# Altium schematic sheet AirBee.SchDoc
size A4
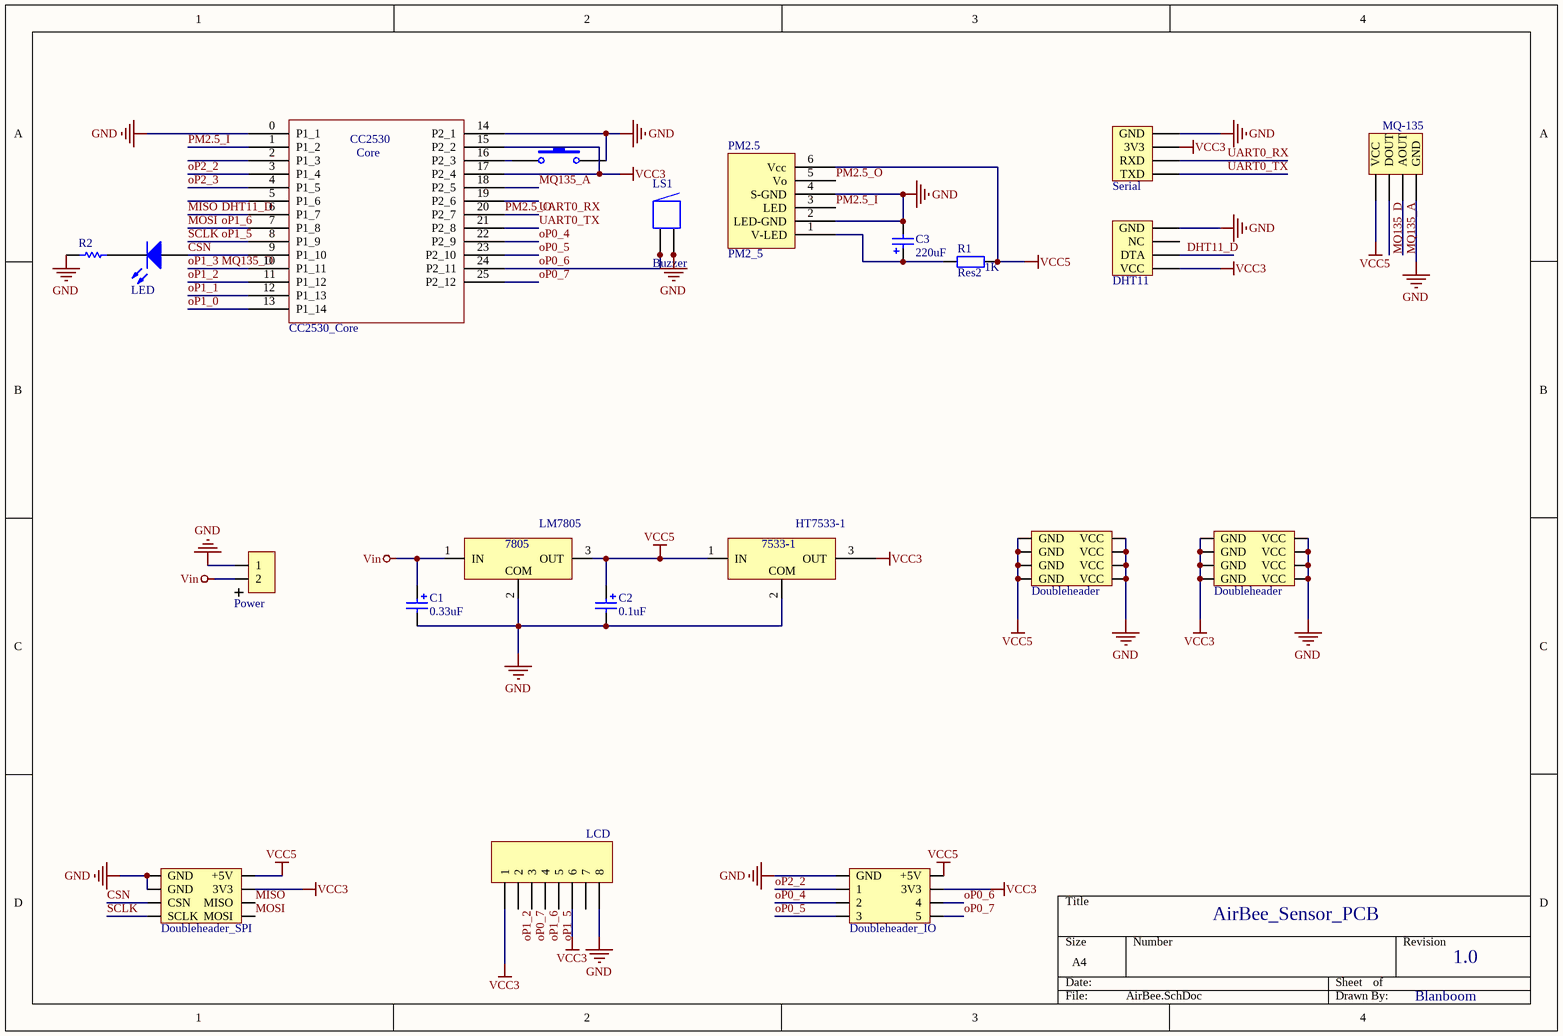
[diagram p0: AirBee.SchDoc]

## Parts
2530  CC2530_Core  [CC2530_Core]
7533  HT7533-1  [PNP]
7805  LM7805  [7805]
C1  0.33uF  [CAP-10uF]
C2  0.1uF  [CAP-10uF]
C3  220uF  [CAP-100uF]
D1  LED  [LED]
DHT11  DHT11  [DHT11]  (value not drawn)
IO2  Doubleheader_IO  [header16]
LCD  HEAder8  [header8]  (value not drawn)
LS1  Buzzer  [5V-BUZZER]
MQ-135  MQ_135  [MQ_135]  (value not drawn)
PM2.5  PM2_5  [PM2.5]
Power  Power  [dianyuan]
PWR5V  Doubleheader  [header16]
PWR33  Doubleheader  [header16]
R1  Res2  value 1K  [AXIAL-0.4]
R2  Res  [AXIAL-0.3]  (value not drawn)
Reset  Switch  [微动开关]  (value not drawn)
Serial  Serial  [HEADER4]  (value not drawn)
SPI  Doubleheader_SPI  [header16]

## Nets
GND: 2530.0(P1_1) 2530.14(P2_1) 7533.2(COM) 7805.2(COM) C1.2 C2.2 C3.2 DHT11.4(GND) IO2.1(GND) LCD.8 LS1.2 LS1.2A MQ-135.4(GND) PM2.5.2(LED-GND) PM2.5.4(S-GND) Power.1 PWR5V.5(VCC) PWR5V.6(VCC) PWR5V.7(VCC) PWR5V.8(VCC) PWR33.5(VCC) PWR33.6(VCC) PWR33.7(VCC) PWR33.8(VCC) R2.1 Reset.2 Serial.4(GND) SPI.1(GND) SPI.2(GND)
VCC3: 2530.15(P2_2) 2530.17(P2_4) 7533.3(OUT) DHT11.1(VCC) IO2.7(3V3) LCD.1 LCD.6 PWR33.1(GND) PWR33.2(GND) PWR33.3(GND) PWR33.4(GND) Serial.3(3V3) SPI.7(3V3)
VCC5: 7533.1(IN) 7805.3(OUT) C2.1 IO2.8(+5V) MQ-135.1(VCC) PM2.5.6(Vcc) PWR5V.1(GND) PWR5V.2(GND) PWR5V.3(GND) PWR5V.4(GND) R1.1 SPI.8(+5V)
Vin: 7805.1(IN) C1.1 Power.2
CSN: 2530.9(P1_10) D1.1(A) SPI.3(CSN)
DHT11_D: 2530.6(P1_7) DHT11.2(DTA) SPI.6(MISO)  [also labelled MISO]
MOSI: 2530.7(P1_8) LCD.4 SPI.5(MOSI)  [also labelled oP1_6]
MQ135_A: 2530.18(P2_5) MQ-135.3(AOUT)
MQ135_D: 2530.10(P1_11) MQ-135.2(DOUT)  [also labelled oP1_3]
oP0_4: 2530.22(P2_9) IO2.3(2)
oP0_5: 2530.23(P2_10) IO2.4(3)
oP0_6: 2530.24(P2_11) IO2.6(4) LS1.1 LS1.1A
oP0_7: 2530.25(P2_12) IO2.5 LCD.3
oP1_0: 2530.13(P1_14)
oP1_1: 2530.12(P1_13)
oP1_2: 2530.11(P1_12) LCD.2
oP1_5: 2530.8(P1_9) LCD.5 SPI.4(SCLK)  [also labelled SCLK]
oP2_2: 2530.3(P1_4) IO2.2(1)
oP2_3: 2530.4(P1_5)
PM2.5_I: 2530.1(P1_2) PM2.5.3(LED)
PM2.5_O: 2530.20(P2_7) PM2.5.5(Vo) Serial.2(RXD)  [also labelled UART0_RX]
UART0_TX: 2530.21(P2_8) Serial.1(TXD)
Net2530_16: 2530.16(P2_3) Reset.1
NetC3_1: C3.1 PM2.5.1(V-LED) R1.2
NetD1_2: D1.2(K) R2.2

Not connected (* = marked no-connect by the designer): 2530 2(P1_3) 5(P1_6) 19(P2_6); DHT11 3(NC); LCD 7

## Notes on the sheet
- AirBee_Sensor_PCB
- 1.0
- Blanboom
- (in symbol CC2530_Core) CC2530; Core
- (in symbol HT7533-1) 7533-1

## Library data of the parts
7533 = HT7533-1: pin to pad: 1>2 2>3 3>1
C1-C3 = cap
D1 = LED0: Typical INFRARED GaAs LED; Published: 8-Jun-2000; LatestRevisionDate: 08-Jul-2005; LatestRevisionNote: Mech Layer 1 removed.; PackageReference: LED-0; Publisher: Altium Limited
LS1 = Buzzer: Magnetic Transducer Buzzer; Published: 24-Mar-1999; LatestRevisionDate: 17-Dec-2003; LatestRevisionNote: Schematic revised, PCB Footprint replaced.; DatasheetDocument: 17-Dec-2003; PackageReference: ABSM-1574; Publisher: Altium Limited; ComponentLink1Description: Manufacturer Link; ComponentLink1URL: http://www.megastar.com/linecard/buzzmode/index.php
MQ-135 = MQ_135: pin to pad: 1>4 2>3 3>2 4>1
R1 = Res2: Resistor; Published: 8-Jun-2000; LatestRevisionDate: 17-Jul-2002; LatestRevisionNote: Re-released for DXP Platform.; PackageReference: AXIAL-0.4; Publisher: Altium Limited
R2 = Res1: Resistor; Value: 1K; Published: 8-Jun-2000; LatestRevisionDate: 17-Jul-2002; LatestRevisionNote: Re-released for DXP Platform.; PackageReference: AXIAL-0.3; Publisher: Altium Limited